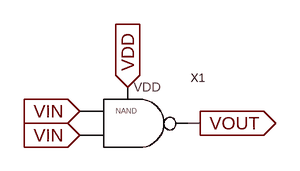
[diagram p0: schematic inverter_2.asc]
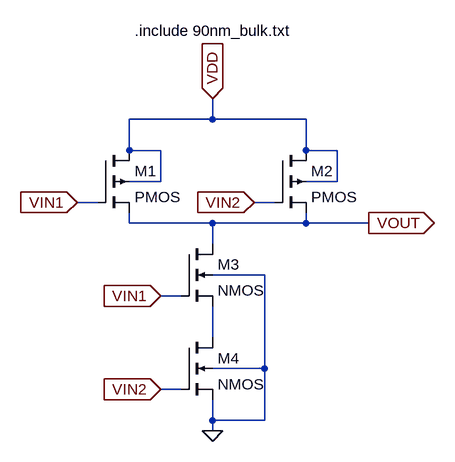
[diagram p1: sub-circuit nand_2.asc]
inverter_2.asc, the LTspice schematic file:
Version 4
SHEET 1 880 680
WIRE 176 64 160 64
FLAG 16 48 VIN
IOPIN 16 48 In
FLAG 16 80 VIN
IOPIN 16 80 In
FLAG 80 16 VDD
IOPIN 80 16 In
FLAG 176 64 VOUT
IOPIN 176 64 Out
SYMBOL nand_2 80 64 R0
SYMATTR InstName X1

nand_2.asc, the sub-circuit schematic file:
Version 4
SHEET 1 1884 788
WIRE 256 -16 256 -48
WIRE 256 -16 128 -16
WIRE 400 -16 256 -16
WIRE 128 32 128 -16
WIRE 176 32 128 32
WIRE 400 32 400 -16
WIRE 448 32 400 32
WIRE 176 80 176 32
WIRE 176 80 128 80
WIRE 448 80 448 32
WIRE 448 80 400 80
WIRE 80 112 48 112
WIRE 352 112 320 112
WIRE 128 144 128 128
WIRE 256 144 128 144
WIRE 400 144 400 128
WIRE 400 144 256 144
WIRE 496 144 400 144
WIRE 256 176 256 144
WIRE 336 224 256 224
WIRE 208 256 176 256
WIRE 256 320 256 272
WIRE 336 368 336 224
WIRE 336 368 256 368
WIRE 208 400 176 400
WIRE 256 448 256 416
WIRE 336 448 336 368
WIRE 336 448 256 448
WIRE 256 464 256 448
FLAG 48 112 VIN1
IOPIN 48 112 In
FLAG 320 112 VIN2
IOPIN 320 112 In
FLAG 256 -48 VDD
IOPIN 256 -48 In
FLAG 496 144 VOUT
IOPIN 496 144 Out
FLAG 176 256 VIN1
IOPIN 176 256 In
FLAG 176 400 VIN2
IOPIN 176 400 In
FLAG 256 464 0
SYMBOL nmos4 208 176 R0
SYMATTR InstName M3
SYMATTR Value2 l=90n w=200n
SYMBOL pmos4 80 32 R0
SYMATTR InstName M1
SYMATTR Value2 l=90n w=400n
SYMBOL pmos4 352 32 R0
SYMATTR InstName M2
SYMATTR Value2 l=90n w=400n
SYMBOL nmos4 208 320 R0
SYMATTR InstName M4
SYMATTR Value2 l=90n w=200n
TEXT 136 -152 Left 2 !.include 90nm_bulk.txt

The netlist it stands for:
* inverter_2.asc
XX1 VIN VIN VDD VOUT nand_2

* block symbol definitions
.subckt nand_2 VIN1 VIN2 VDD VOUT
M3 VOUT VIN1 N001 0 NMOS l=90n w=200n
M1 VDD VIN1 VOUT VDD PMOS l=90n w=400n
M2 VDD VIN2 VOUT VDD PMOS l=90n w=400n
M4 N001 VIN2 0 0 NMOS l=90n w=200n
.include 90nm_bulk.txt
.ends nand_2

.model NMOS NMOS
.model PMOS PMOS
.lib standard.mos
.backanno
.end